# EAGLE schematic RCMX Rev_00 (EAGLE 6.2)
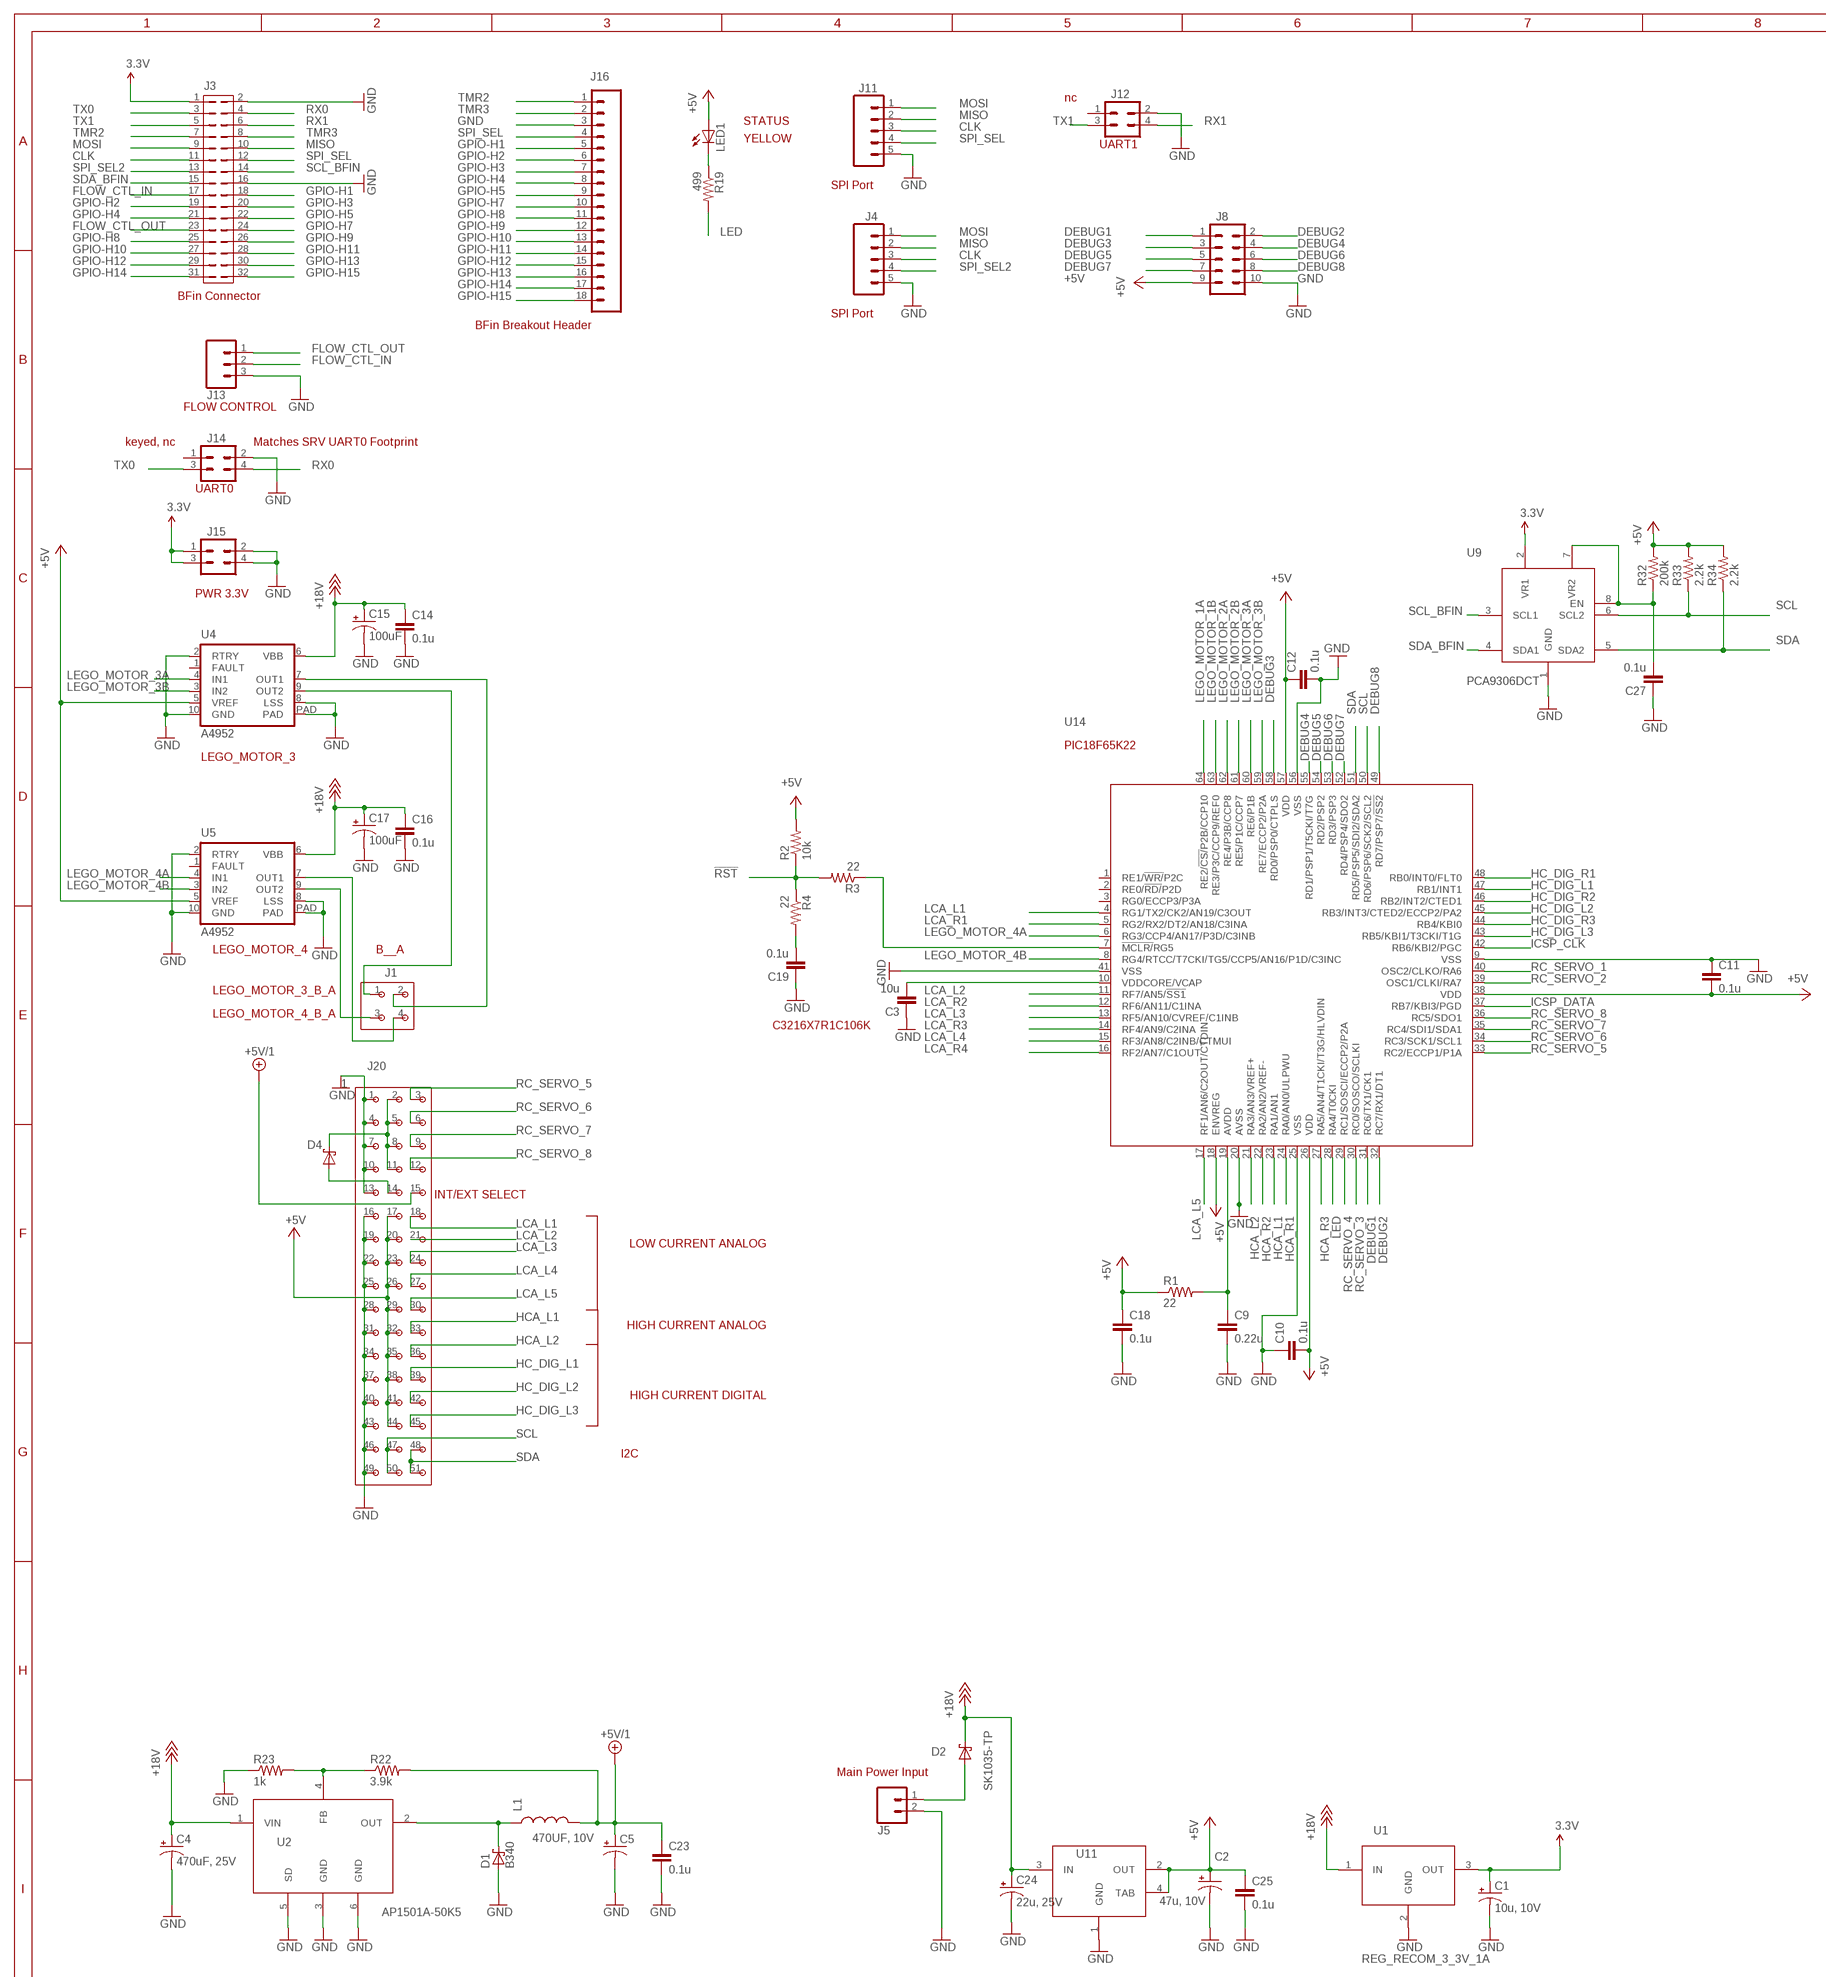
[diagram p0: schematic, sheet 1, part 1 of 2]
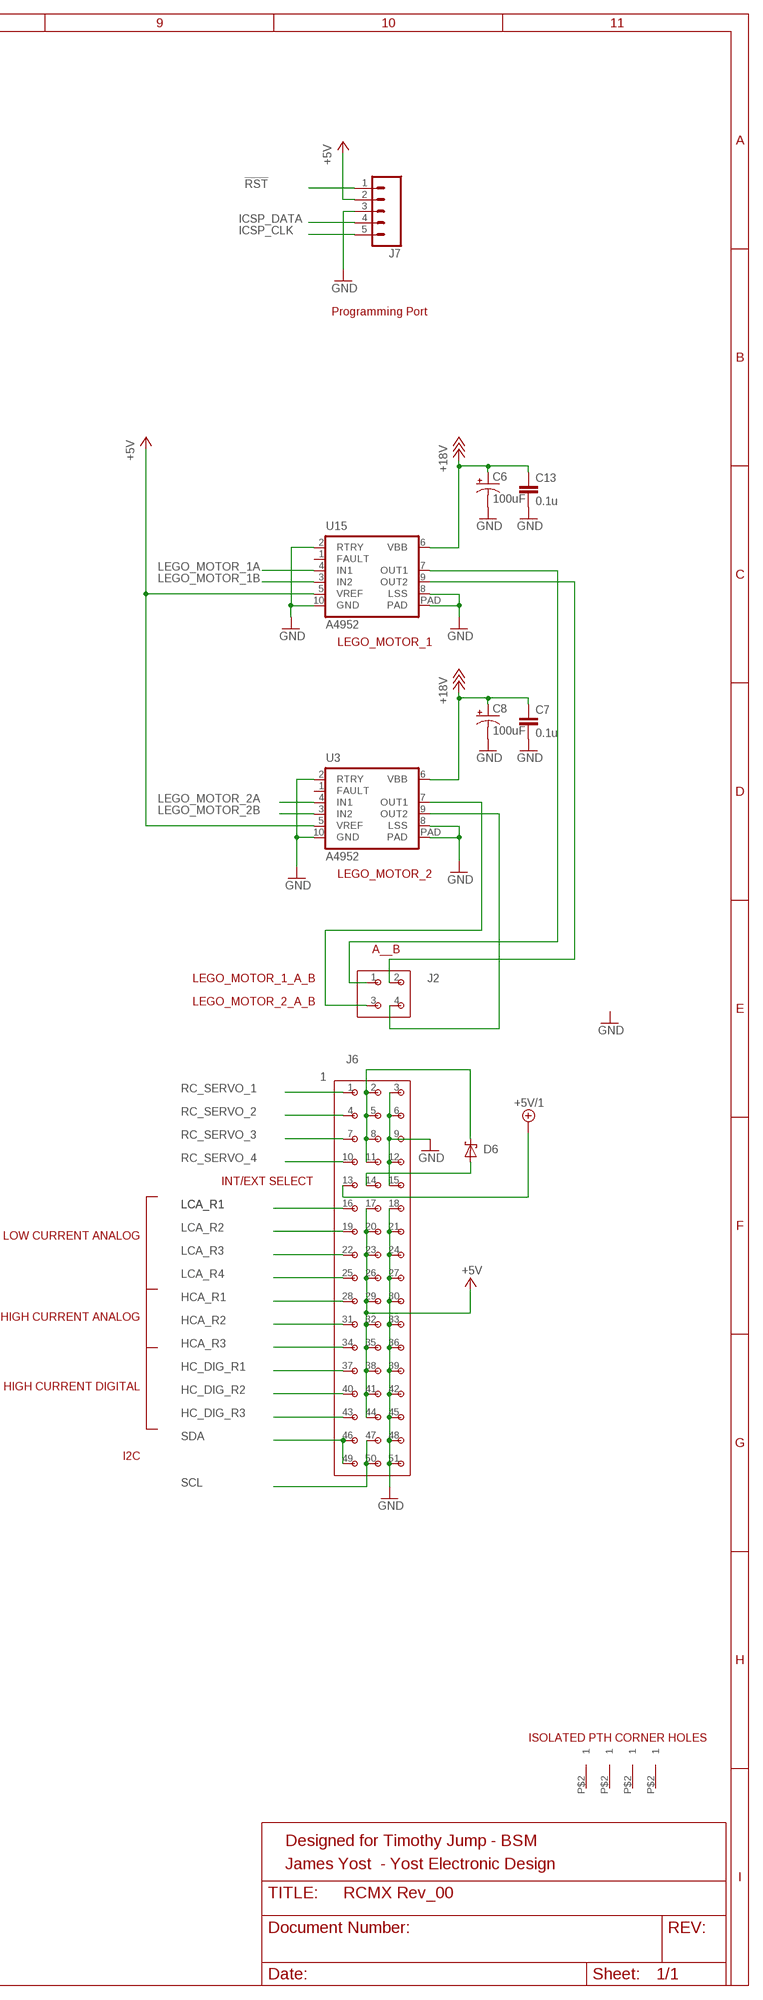
[diagram p1: schematic, sheet 1, part 2 of 2]

## Parts
C1  10u, 10V  CAP_POL1206  [EIA3216]
C2  47u, 10V  CAP_1210_POL  [CAP1210_POL]
C3  10u  CAP1206  [1206]
C4  470uF, 25V  CAP_POLG  [PANASONIC_G]
C5  470UF, 10V  CAP_ELT_PANASONIC_470UF  [PANASONIC_F]
C6  100uF  CAP_POLD  [PANASONIC_D]
C7  0.1u  CAP0805  [0805]
C8  100uF  CAP_POLD  [PANASONIC_D]
C9  0.22u  CAP0805  [0805]
C10  0.1u  CAP0805  [0805]
C11  0.1u  CAP0805  [0805]
C12  0.1u  CAP0805  [0805]
C13  0.1u  CAP0805  [0805]
C14  0.1u  CAP0805  [0805]
C15  100uF  CAP_POLD  [PANASONIC_D]
C16  0.1u  CAP0805  [0805]
C17  100uF  CAP_POLD  [PANASONIC_D]
C18  0.1u  CAP0805  [0805]
C19  0.1u  CAP0805  [0805]
C23  0.1u  CAP0805  [0805]
C24  22u, 25V  CAP_1210_POL  [CAP1210_POL]
C25  0.1u  CAP0805  [0805]
C27  0.1u  CAP0805  [0805]
D1  B340  [SMA_DO214AC]
D2  SK1035-TP  [DO214AB]
D4  SK1035-TP  [DO214AB]
D6  SK1035-TP  [DO214AB]
J1  CON_2X2_0_100  [CON_2X2_0_100]
J2  CON_2X2_0_100  [CON_2X2_0_100]
J3  CON_2X16_0_100  [CON_2X16_0_100]
J4  M05PTH  [1X05]
J5  M02NG  [1X02]
J6  CON_3X17_0_100  [CON_3X17_0_100]
J7  M05PTH  [1X05]
J8  M05X2PTH  [AVR_ICSP]
J11  M05PTH  [1X05]
J12  CON2X2  [CON2X2]
J13  M03PTH  [1X03]
J14  CON2X2  [CON2X2]
J15  CON2X2  [CON2X2]
J16  CON1X18  [CON1X18]
J20  CON_3X17_0_100  [CON_3X17_0_100]
L1  IND_47UH_COILTRONICS_2_95A  [IND_PADS_SMT]
LED1  LEDCHIP-LED0805  [CHIP-LED0805]
R1  22  RESISTOR  [0805]
R2  10k  RESISTOR  [0805]
R3  22  RESISTOR  [0805]
R4  22  RESISTOR  [0805]
R19  499  RESISTOR  [0805]
R22  3.9k  RESISTOR  [0805]
R23  1k  RESISTOR  [0805]
R32  200k  RESISTOR  [0805]
R33  2.2k  RESISTOR  [0805]
R34  2.2k  RESISTOR  [0805]
U1  REG_RECOM_3_3V_1A  [REG_RECOM_3_3V_1A]
U2  AP1501A-50K5  [TO263-5]
U3  A4952  [MSOP10_W_THERMAL_PAD]
U4  A4952  [MSOP10_W_THERMAL_PAD]
U5  A4952  [MSOP10_W_THERMAL_PAD]
U9  PCA9306DCT  [TEST08]
U11  TLV1117-5  [SOT223]
U14  MICRO_C_PIC18F65K22  [64PIN_TQFP_10X10X1MM]
U15  A4952  [MSOP10_W_THERMAL_PAD]
U$1  GNDPAD  [GNDPAD]
U$2  GNDPAD  [GNDPAD]
U$7  GNDPAD  [GNDPAD]
U$8  GNDPAD  [GNDPAD]

## Nets
3.3V: C1.A(+) J3.1 J15.1 J15.3 U1.3(OUT) U9.2(VR1)
!RST: J7.1 R2.1 R3.2 R4.1
+5V: C2.1(+) C10.2 C11.2 C12.1 C18.1 C25.1 J6.17 J6.20 J6.23 J6.26 J6.29 J6.32 J6.35 J6.38 J6.41 J6.44 J7.2 J8.9 J20.17 J20.20 J20.23 J20.26 J20.29 J20.32 J20.35 J20.38 J20.41 J20.44 LED1.A R1.1 R2.2 R32.2 R33.2 R34.2 U3.5(VREF) U4.5(VREF) U5.5(VREF) U11.2(OUT) U11.4(TAB) U14.18(ENVREG) U14.26(VDD) U14.38(VDD) U14.57(VDD) U15.5(VREF)
+5V/1: C5.+ C23.1 J6.13 J20.15 L1.2 R22.2
+18V: C4.+ C6.+ C7.1 C8.+ C13.1 C14.1 C15.+ C16.1 C17.+ C24.1(+) D2.1(C) U1.1(IN) U2.1(VIN) U3.6(VBB) U4.6(VBB) U5.6(VBB) U11.3(IN) U15.6(VBB)
CLK: J3.11 J4.3 J11.3
DEBUG1: J8.1 U14.31(RC6/TX1/CK1)
DEBUG2: J8.2 U14.32(RC7/RX1/DT1)
DEBUG3: J8.3 U14.58(RD0/PSP0/CTPLS)
DEBUG4: J8.4 U14.55(RD1/PSP1/T5CKI/T7G)
DEBUG5: J8.5 U14.54(RD2/PSP2)
DEBUG6: J8.6 U14.53(RD3/PSP3)
DEBUG7: J8.7 U14.52(RD4/PSP4/SDO2)
DEBUG8: J8.8 U14.49(RD7/PSP7/!SS2)
FLOW_CTL_IN: J3.17 J13.2
FLOW_CTL_OUT: J3.23 J13.1
GND: C1.C(-) C2.2(-) C3.1 C4.- C5.- C6.- C7.2 C8.- C9.2 C10.1 C11.1 C12.2 C13.2 C14.2 C15.- C16.2 C17.- C18.2 C19.1 C23.2 C24.2(-) C25.2 C27.1 D1.A J3.2 J3.16 J4.5 J5.2 J6.3 J6.6 J6.9 J6.12 J6.15 J6.18 J6.21 J6.24 J6.27 J6.30 J6.33 J6.36 J6.39 J6.42 J6.45 J6.48 J6.51 J7.3 J8.10 J11.5 J12.2 J13.3 J14.2 J15.2 J15.4 J16.3 J20.1 J20.4 J20.7 J20.10 J20.13 J20.16 J20.19 J20.22 J20.25 J20.28 J20.31 J20.34 J20.37 J20.40 J20.43 J20.46 J20.49 R23.1 U1.2(GND) U2.3(GND) U2.5(SD) U2.6(GND) U3.2(RTRY) U3.8(LSS) U3.10(GND) U3.PAD U4.2(RTRY) U4.8(LSS) U4.10(GND) U4.PAD U5.2(RTRY) U5.8(LSS) U5.10(GND) U5.PAD U9.1(GND) U11.1(GND) U14.9(VSS) U14.20(AVSS) U14.25(VSS) U14.41(VSS) U14.56(VSS) U15.2(RTRY) U15.8(LSS) U15.10(GND) U15.PAD
GPIO-H1: J3.18 J16.5
GPIO-H2: J3.19 J16.6
GPIO-H3: J3.20 J16.7
GPIO-H4: J3.21 J16.8
GPIO-H5: J3.22 J16.9
GPIO-H7: J3.24 J16.10
GPIO-H8: J3.25 J16.11
GPIO-H9: J3.26 J16.12
GPIO-H10: J3.27 J16.13
GPIO-H11: J3.28 J16.14
GPIO-H12: J3.29 J16.15
GPIO-H13: J3.30 J16.16
GPIO-H14: J3.31 J16.17
GPIO-H15: J3.32 J16.18
HC_DIG_L1: J20.39 U14.47(RB1/INT1)
HC_DIG_L2: J20.42 U14.45(RB3/INT3/CTED2/ECCP2/PA2)
HC_DIG_L3: J20.45 U14.43(RB5/KBI1/T3CKI/T1G)
HC_DIG_R1: J6.37 U14.48(RB0/INT0/FLT0)
HC_DIG_R2: J6.40 U14.46(RB2/INT2/CTED1)
HC_DIG_R3: J6.43 U14.44(RB4/KBI0)
HCA_L1: J20.33 U14.23(RA1/AN1)
HCA_L2: J20.36 U14.21(RA3/AN3/VREF+)
HCA_R1: J6.28 U14.24(RA0/AN0/ULPWU)
HCA_R2: J6.31 U14.22(RA2/AN2/VREF-)
HCA_R3: J6.34 U14.27(RA5/AN4/T1CKI/T3G/HLVDIN)
ICSP_CLK: J7.5 U14.42(RB6/KBI2/PGC)
ICSP_DATA: J7.4 U14.37(RB7/KBI3/PGD)
LCA_L1: J20.18 U14.4(RG1/TX2/CK2/AN19/C3OUT)
LCA_L2: J20.21 U14.11(RF7/AN5/!SS1)
LCA_L3: J20.24 U14.13(RF5/AN10/CVREF/C1INB)
LCA_L4: J20.27 U14.15(RF3/AN8/C2INB/CTMUI)
LCA_L5: J20.30 U14.17(RF1/AN6/C2OUT/CTDIN)
LCA_R1: J6.16 U14.5(RG2/RX2/DT2/AN18/C3INA)
LCA_R2: J6.19 U14.12(RF6/AN11/C1INA)
LCA_R3: J6.22 U14.14(RF4/AN9/C2INA)
LCA_R4: J6.25 U14.16(RF2/AN7/C1OUT)
LED: R19.2 U14.28(RA4/T0CKI)
LEGO_1A: J2.1 U15.7(OUT1)
LEGO_1B: J2.2 U15.9(OUT2)
LEGO_2A: J2.3 U3.7(OUT1)
LEGO_2B: J2.4 U3.9(OUT2)
LEGO_4A: J1.4 U5.7(OUT1)
LEGO_4B: J1.3 U5.9(OUT2)
LEGO_MOTOR_1A: U14.64(RE2/!CS/!P2B/CCP10) U15.4(IN1)
LEGO_MOTOR_1B: U14.63(RE3/P3C/CCP9/REF0) U15.3(IN2)
LEGO_MOTOR_2A: U3.4(IN1) U14.62(RE4/P3B/CCP8)
LEGO_MOTOR_2B: U3.3(IN2) U14.61(RE5/P1C/CCP7)
LEGO_MOTOR_3A: U4.4(IN1) U14.60(RE6/P1B)
LEGO_MOTOR_3B: U4.3(IN2) U14.59(RE7/ECCP2/P2A)
LEGO_MOTOR_4A: U5.4(IN1) U14.6(RG3/CCP4/AN17/P3D/C3INB)
LEGO_MOTOR_4B: U5.3(IN2) U14.8(RG4/RTCC/T7CKI/TG5/CCP5/AN16/P1D/C3INC)
MISO: J3.10 J4.2 J11.2
MOSI: J3.9 J4.1 J11.1
N$1: D1.C L1.1 U2.2(OUT)
N$3: R3.1 U14.7(!MCLR/!RG5)
N$5: D6.2(A) J6.14
N$6: D6.1(C) J6.2 J6.5 J6.8 J6.11
N$9: C19.2 R4.2
N$12: D4.1(C) J20.2 J20.5 J20.8 J20.11
N$18: C9.1 R1.2 U14.19(AVDD)
N$26: D2.2(A) J5.1
N$31: J1.2 U4.7(OUT1)
N$32: J1.1 U4.9(OUT2)
N$34: R22.1 R23.2 U2.4(FB)
N$37: C3.2 U14.10(VDDCORE/VCAP)
N$39: D4.2(A) J20.14
N$40: C27.2 R32.1 U9.7(VR2) U9.8(EN)
N$42: LED1.C R19.1
RC_SERVO_1: J6.1 U14.40(OSC2/CLKO/RA6)
RC_SERVO_2: J6.4 U14.39(OSC1/CLKI/RA7)
RC_SERVO_3: J6.7 U14.30(RC0/SOSCO/SCLKI)
RC_SERVO_4: J6.10 U14.29(RC1/SOSCI/ECCP2/P2A)
RC_SERVO_5: J20.3 U14.33(RC2/ECCP1/P1A)
RC_SERVO_6: J20.6 U14.34(RC3/SCK1/SCL1)
RC_SERVO_7: J20.9 U14.35(RC4/SDI1/SDA1)
RC_SERVO_8: J20.12 U14.36(RC5/SDO1)
RX0: J3.4 J14.4
RX1: J3.6 J12.4
SCL: J6.47 J6.50 J20.47 J20.50 R33.1 U9.6(SCL2) U14.50(RD6/PSP6/SCK2/SCL2)
SCL_BFIN: J3.14 U9.3(SCL1)
SDA: J6.46 J6.49 J20.48 J20.51 R34.1 U9.5(SDA2) U14.51(RD5/PSP5/SDI2/SDA2)
SDA_BFIN: J3.15 U9.4(SDA1)
SPI_SEL: J3.12 J11.4 J16.4
SPI_SEL2: J3.13 J4.4
TMR2: J3.7 J16.1
TMR3: J3.8 J16.2
TX0: J3.3 J14.3
TX1: J3.5 J12.3
Unconnected: J12.1 J14.1 U3.1(FAULT) U4.1(FAULT) U5.1(FAULT) U14.1(RE1/!WR/!P2C) U14.2(RE0/!RD/!P2D) U14.3(RG0/ECCP3/P3A) U15.1(FAULT) U$1.P$2 U$2.P$2 U$7.P$2 U$8.P$2

## Notes on the sheet
- nc
- STATUS
- YELLOW
- UART1
- SPI Port
- BFin Connector
- SPI Port | Programming Port
- BFin Breakout Header
- FLOW CONTROL
- keyed, nc | Matches SRV UART0 Footprint
- UART0
- PWR 3.3V
- LEGO_MOTOR_1
- PIC18F65K22
- LEGO_MOTOR_3
- LEGO_MOTOR_2
- LEGO_MOTOR_4 | B__A
- A__B
- LEGO_MOTOR_1_A_B
- LEGO_MOTOR_3_B_A
- LEGO_MOTOR_2_A_B
- LEGO_MOTOR_4_B_A
- C3216X7R1C106K
- INT/EXT SELECT
- INT/EXT SELECT
- LOW CURRENT ANALOG | LOW CURRENT ANALOG
- HIGH CURRENT ANALOG | HIGH CURRENT ANALOG
- HIGH CURRENT DIGITAL | HIGH CURRENT DIGITAL
- I2C
- I2C
- ISOLATED PTH CORNER HOLES
- Main Power Input
- Designed for Timothy Jump - BSM
- James Yost  - Yost Electronic Design

## Library data of the parts
C1 C4 = SparkFun:CAP_POL: Capacitor Polarized These are standard SMD and PTH capacitors. Normally 10uF, 47uF, and 100uF in electrolytic and tantalum varieties. Always verify the external diameter of the through hole cap, it varies with capacity, voltage, and manufacturer. The EIA devices should be standard.
C2 C24 = JLY Parts:CAP_1210_POL: Polarized Capacitor, 1210 Size, SMT
C3 = SparkFun-Passives:CAP: Capacitor Standard 0603 ceramic capacitor, and 0.1" leaded capacitor.
C5 = JLY Parts:CAP_ELT_PANASONIC_470UF: 470UF 10V ELECT, Panasonic - ECG, EEE-FP1A471AP, Digikey PCE4526CT-ND
C6 C8 C15 C17 = SparkFun-Passives:CAP_POL: Capacitor Polarized These are standard SMD and PTH capacitors. Normally 10uF, 47uF, and 100uF in electrolytic and tantalum varieties. Always verify the external diameter of the through hole cap, it varies with capacity, voltage, and manufacturer. The EIA devices should be standard.
C7 C9-C14 C16 C18 C19 C23 C25 C27 = SparkFun:CAP: Capacitor Standard 0603 ceramic capacitor, and 0.1" leaded capacitor.
D1 = JLY Parts:B340
D2 D4 D6 = JLY Parts:SK1035-TP: DIODE SCHOTTKY 10A 35V DO-214AB, Micro Commercial Co, Digikey SK1035-TPCT-ND
J1 J2 = JLY Parts_V_5_11:CON_2X2_0_100
J3 = JLY Parts:CON_2X16_0_100
J4 J11 = SparkFun:M05: Header 5 Standard 5-pin 0.1" header. Use with straight break away headers (SKU : PRT-00116), right angle break away headers (PRT-00553), swiss pins (PRT-00743), machine pins (PRT-00117), and female headers (PRT-00115). Molex polarized connector foot print use with SKU : PRT-08230 with associated crimp pins and housings.
J5 = SparkFun:M02NG
J6 J20 = JLY Parts_V_5_11:CON_3X17_0_100
J7 = SparkFun-Connectors:M05: Header 5 Standard 5-pin 0.1" header. Use with straight break away headers (SKU : PRT-00116), right angle break away headers (PRT-00553), swiss pins (PRT-00743), machine pins (PRT-00117), and female headers (PRT-00115). Molex polarized connector foot print use with SKU : PRT-08230 with associated crimp pins and housings.
J8 = SparkFun-Connectors:M05X2: Header 5x2 Standard 10-pin dual row 0.1" header. Commonly used with AVR-ISP. Use with Spark Fun Electronics SKU: PRT-00778
J12 J14 J15 = JLY Parts:CON2X2
J13 = SparkFun:M03: Header 3 Standard 3-pin 0.1" header. Use with straight break away headers (SKU : PRT-00116), right angle break away headers (PRT-00553), swiss pins (PRT-00743), machine pins (PRT-00117), and female headers (PRT-00115). Molex polarized connector foot print use with SKU : PRT-08232 with associated crimp pins and housings.
J16 = JLY Parts:CON1X18: Connector 1x18 with 0.1" spacing
L1 = JLY Parts:IND_47UH_COILTRONICS_2_95A: 47UH SMD DR Coiltronics, DR127-470-R, Digikey 513-1050-6-ND, INDUCTOR SHIELD
LED1 = led:LED: LED OSRAM: - CHIPLED LG R971, LG N971, LY N971, LG Q971, LY Q971, LO R971, LY R971 LH N974, LH R974 LS Q976, LO Q976, LY Q976 LO Q996 - Hyper CHIPLED LW Q18S LB Q993, LB Q99A, LB R99A - SideLED LS A670, LO A670, LY A670, LG A670, LP A670 LB A673, LV A673, LT A673, LW A673 LH A674 LY A675 LS A676, LA A676, LO A676, LY A676, LW A676 LS A679, LY A679, LG A679 - Hyper Micro SIDELED® LS Y876, LA Y876, LO Y876, LY Y876 LT Y87S - SmartLED LW L88C, LW L88S LB L89C, LB L89S, LG L890 LS L89K, LO L89K, LY L89K LS L896, LA L896, LO L896, LY L896 - TOPLED LS T670, LO T670, LY T670, LG T670, LP T670 LSG T670, LSP T670, LSY T670, LOP T670, LYG T670 LG T671, LOG T671, LSG T671 LB T673, LV T673, LT T673, LW T673 LH T674 LS T676, LA T676, LO T676, LY T676, LB T676, LH T676, LSB T676, LW T676 LB T67C, LV T67C, LT T67C, LS T67K, LO T67K, LY T67K, LW E67C LS E67B, LA E67B, LO E67B, LY E67B, LB E67C, LV E67C, LT E67C LW T67C LS T679, LY T679, LG T679 LS T770, LO T770, LY T770, LG T770, LP T770 LB T773, LV T773, LT T773, LW T773 LH T774 LS E675, LA E675, LY E675, LS T675 LS T776, LA T776, LO T776, LY T776, LB T776 LHGB T686 LT T68C, LB T68C - Hyper Mini TOPLED® LB M676 - Mini TOPLED Santana® LG M470 LS M47K, LO M47K, LY M47K Source: http://www.osram.convergy.de LUXEON: - LUMILED® LXK2-PW12-R00, LXK2-PW12-S00, LXK2-PW14-U00, LXK2-PW14-V00 LXK2-PM12-R00, LXK2-PM12-S00, LXK2-PM14-U00 LXK2-PE12-Q00, LXK2-PE12-R00, LXK2-PE12-S00, LXK2-PE14-T00, LXK2-PE14-U00 LXK2-PB12-K00, LXK2-PB12-L00, LXK2-PB12-M00, LXK2-PB14-N00, LXK2-PB14-P00, LXK2-PB14-Q00 LXK2-PR12-L00, LXK2-PR12-M00, LXK2-PR14-Q00, LXK2-PR14-R00 LXK2-PD12-Q00, LXK2-PD12-R00, LXK2-PD12-S00 LXK2-PH12-R00, LXK2-PH12-S00 LXK2-PL12-P00, LXK2-PL12-Q00, LXK2-PL12-R00 Source: www.luxeon.com KINGBRIGHT: KA-3528ASYC Source: www.kingbright.com
R1-R4 R19 R22 R23 R32-R34 = SparkFun:RESISTOR: Resistor Basic schematic elements and footprints for 0603, 1206, and PTH 1/10th watt (small) resistors.
U1 = JLY Parts:REG_RECOM_3_3V_1A: REG DC/DC 1A 3.3V OUT SIP VERT Innoline R-78-1.0 Recom Power Inc, Digikey 945-1036-ND
U2 = JLY Parts:AP1501A-50K5: Buck Regulator 5V, Diodes Inc, AP1501A-50K5L-1, Digikey AP1501A-50K5LDICT-ND, DC-DC 5A 5.0V TO263-5L
U3-U5 U15 = JLY_Parts:A4952: PWM Motor Driver, A4952, Allegro A4952ELYTR-T, Digikey 620-1451-1-ND, MSOP10 pkg
U9 = JLY Parts:PCA9306DCT
U11 = JLY Parts:TLV1117-5
U14 = JLY_Parts:MICRO_C_PIC18F65K22: Micro_C, PIC18F65K22, 64PIN_TQFP
U$1 U$2 U$7 U$8 = JLY Parts:GNDPAD: Pad, round, 0.125 ID, 0.250 OD